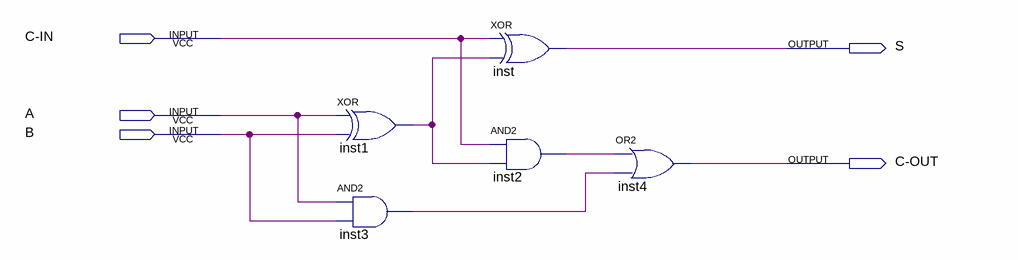
[diagram p0: schematic sheet]
// Quartus schematic NMMS3_1.bdf as structural Verilog: 5 symbols, 5 pins
module NMMS3_1 (
  input  \C-IN ,
  input  A,
  input  B,
  output S,
  output \C-OUT 
);

  wire inst1_out, inst2_out, inst3_out;

  xor inst1 (inst1_out, A, B);
  and inst3 (inst3_out, A, B);
  xor inst (S, \C-IN , inst1_out);
  and inst2 (inst2_out, \C-IN , inst1_out);
  or inst4 (\C-OUT , inst2_out, inst3_out);
endmodule
